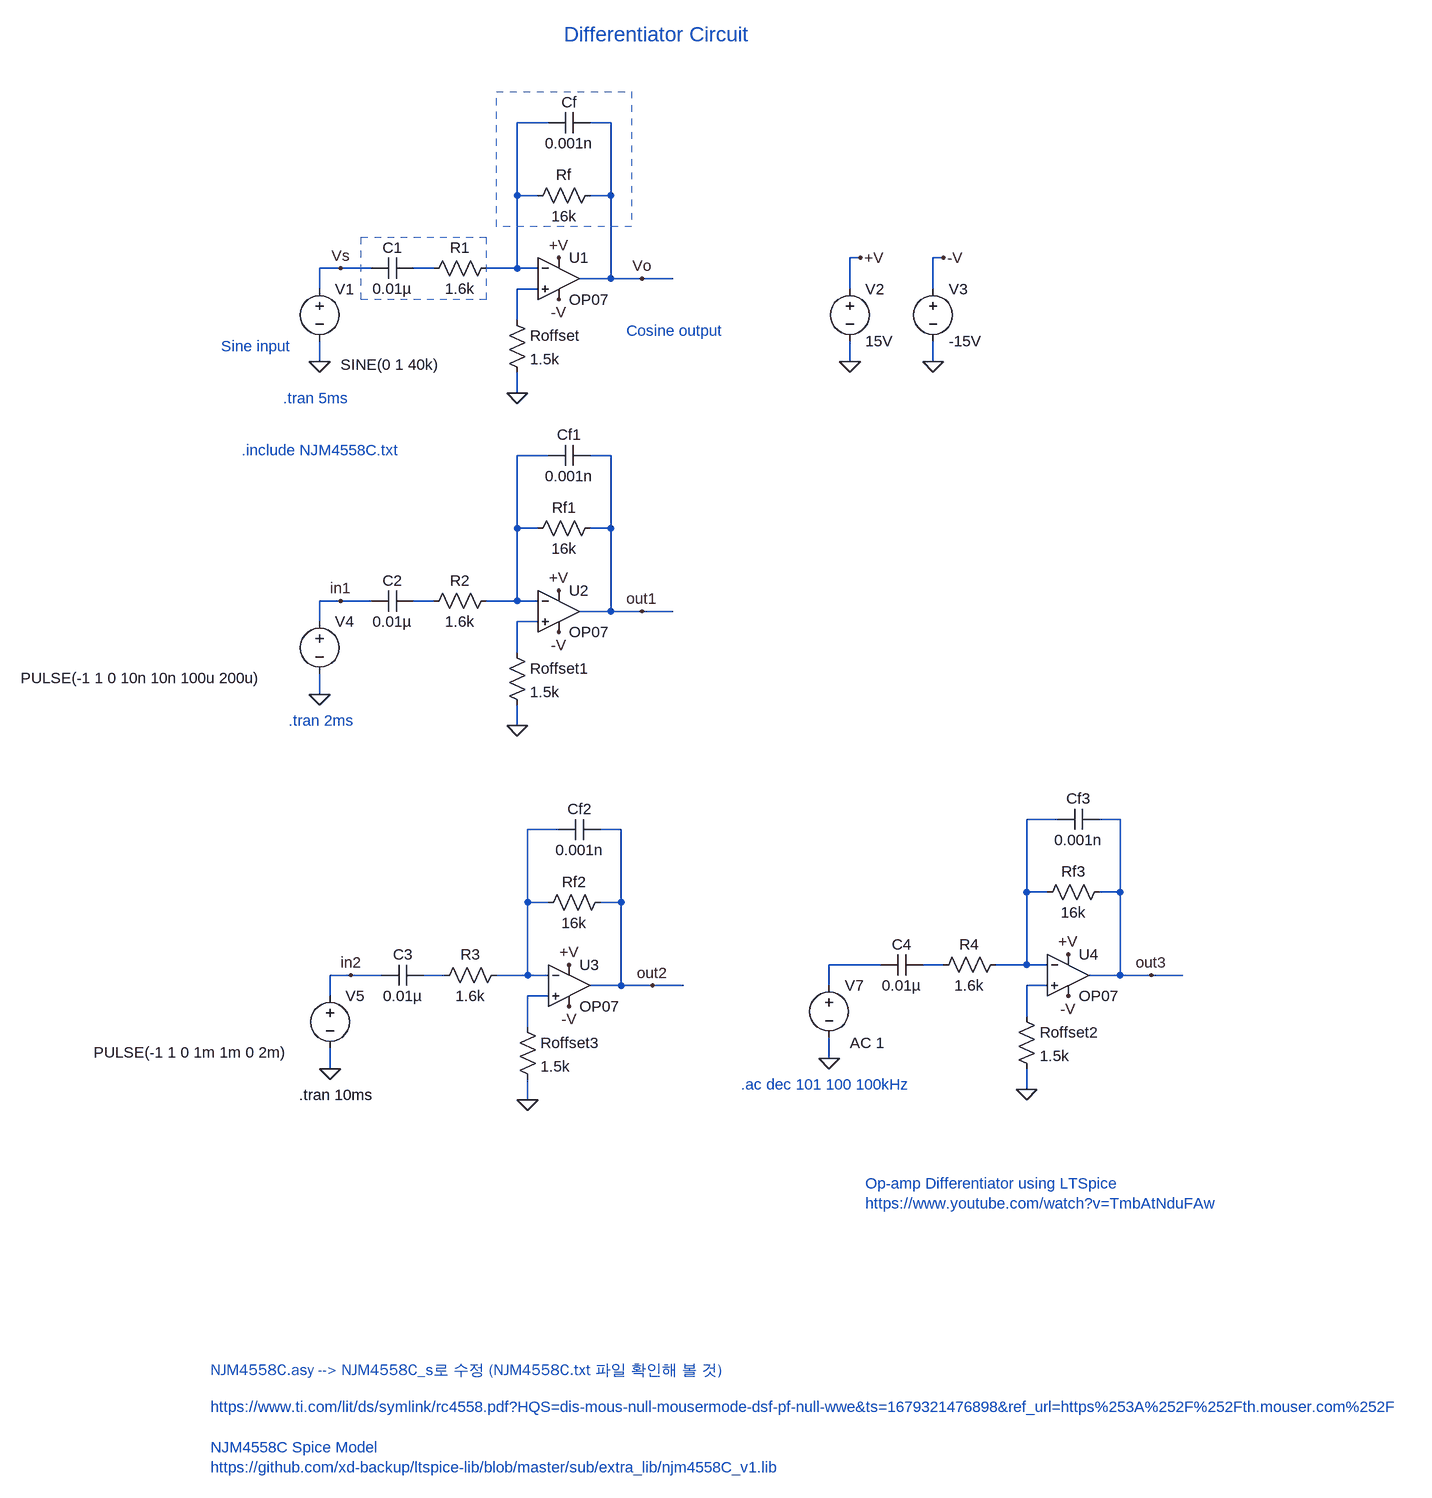
[diagram p0: schematic Differentialtor.asc]
Differentialtor.asc, the LTspice schematic file:
Version 4
SHEET 1 2012 1856
WIRE 96 -240 48 -240
WIRE 192 -240 160 -240
WIRE 48 -128 48 -240
WIRE 80 -128 48 -128
WIRE 192 -128 192 -240
WIRE 192 -128 160 -128
WIRE 576 -32 560 -32
WIRE 704 -32 688 -32
WIRE -224 -16 -256 -16
WIRE -176 -16 -224 -16
WIRE -80 -16 -112 -16
WIRE 48 -16 48 -128
WIRE 48 -16 0 -16
WIRE 80 -16 48 -16
WIRE 192 0 192 -128
WIRE 192 0 144 0
WIRE 240 0 192 0
WIRE 288 0 240 0
WIRE -256 16 -256 -16
WIRE 80 16 48 16
WIRE 560 16 560 -32
WIRE 688 16 688 -32
WIRE 48 64 48 16
WIRE -256 128 -256 96
WIRE 560 128 560 96
WIRE 688 128 688 96
WIRE 48 176 48 144
WIRE 96 272 48 272
WIRE 192 272 160 272
WIRE 48 384 48 272
WIRE 80 384 48 384
WIRE 192 384 192 272
WIRE 192 384 160 384
WIRE -224 496 -256 496
WIRE -176 496 -224 496
WIRE -80 496 -112 496
WIRE 48 496 48 384
WIRE 48 496 0 496
WIRE 80 496 48 496
WIRE 192 512 192 384
WIRE 192 512 144 512
WIRE 240 512 192 512
WIRE 288 512 240 512
WIRE -256 528 -256 496
WIRE 80 528 48 528
WIRE 48 576 48 528
WIRE -256 640 -256 608
WIRE 48 688 48 656
WIRE 880 832 832 832
WIRE 976 832 944 832
WIRE 112 848 64 848
WIRE 208 848 176 848
WIRE 832 944 832 832
WIRE 864 944 832 944
WIRE 976 944 976 832
WIRE 976 944 944 944
WIRE 64 960 64 848
WIRE 96 960 64 960
WIRE 208 960 208 848
WIRE 208 960 176 960
WIRE 608 1056 528 1056
WIRE 704 1056 672 1056
WIRE 832 1056 832 944
WIRE 832 1056 784 1056
WIRE 864 1056 832 1056
WIRE -208 1072 -240 1072
WIRE -160 1072 -208 1072
WIRE -64 1072 -96 1072
WIRE 64 1072 64 960
WIRE 64 1072 16 1072
WIRE 96 1072 64 1072
WIRE 976 1072 976 944
WIRE 976 1072 928 1072
WIRE 1024 1072 976 1072
WIRE 1072 1072 1024 1072
WIRE 208 1088 208 960
WIRE 208 1088 160 1088
WIRE 256 1088 208 1088
WIRE 304 1088 256 1088
WIRE 528 1088 528 1056
WIRE 864 1088 832 1088
WIRE -240 1104 -240 1072
WIRE 96 1104 64 1104
WIRE 832 1136 832 1088
WIRE 64 1152 64 1104
WIRE 528 1200 528 1168
WIRE -240 1216 -240 1184
WIRE 832 1248 832 1216
WIRE 64 1264 64 1232
FLAG -256 128 0
FLAG 560 128 0
FLAG 576 -32 +V
FLAG 688 128 0
FLAG 704 -32 -V
FLAG 112 -32 +V
FLAG 112 32 -V
FLAG -224 -16 Vs
FLAG 48 176 0
FLAG 240 0 Vo
FLAG -256 640 0
FLAG 112 480 +V
FLAG 112 544 -V
FLAG -224 496 in1
FLAG 48 688 0
FLAG 240 512 out1
FLAG -240 1216 0
FLAG 128 1056 +V
FLAG 128 1120 -V
FLAG -208 1072 in2
FLAG 64 1264 0
FLAG 256 1088 out2
FLAG 528 1200 0
FLAG 896 1040 +V
FLAG 896 1104 -V
FLAG 832 1248 0
FLAG 1024 1072 out3
SYMBOL res 16 -32 R90
WINDOW 0 0 56 VBottom 2
WINDOW 3 32 56 VTop 2
SYMATTR InstName R1
SYMATTR Value 1.6k
SYMBOL res 176 -144 R90
WINDOW 0 0 56 VBottom 2
WINDOW 3 32 56 VTop 2
SYMATTR InstName Rf
SYMATTR Value 16k
SYMBOL voltage 560 0 R0
SYMATTR InstName V2
SYMATTR Value 15V
SYMBOL voltage 688 0 R0
SYMATTR InstName V3
SYMATTR Value -15V
SYMBOL cap -112 -32 R90
WINDOW 0 0 32 VBottom 2
WINDOW 3 32 32 VTop 2
SYMATTR InstName C1
SYMATTR Value 0.01µ
SYMBOL res 32 48 R0
SYMATTR InstName Roffset
SYMATTR Value 1.5k
SYMBOL cap 160 -256 R90
WINDOW 0 0 32 VBottom 2
WINDOW 3 32 32 VTop 2
SYMATTR InstName Cf
SYMATTR Value 0.001n
SYMBOL Opamps\\OP07 112 -64 R0
SYMATTR InstName U1
SYMBOL voltage -256 512 R0
WINDOW 123 0 0 Left 0
WINDOW 39 0 0 Left 0
WINDOW 3 -460 103 Left 2
SYMATTR Value PULSE(-1 1 0 10n 10n 100u 200u)
SYMATTR InstName V4
SYMBOL res 16 480 R90
WINDOW 0 0 56 VBottom 2
WINDOW 3 32 56 VTop 2
SYMATTR InstName R2
SYMATTR Value 1.6k
SYMBOL res 176 368 R90
WINDOW 0 0 56 VBottom 2
WINDOW 3 32 56 VTop 2
SYMATTR InstName Rf1
SYMATTR Value 16k
SYMBOL cap -112 480 R90
WINDOW 0 0 32 VBottom 2
WINDOW 3 32 32 VTop 2
SYMATTR InstName C2
SYMATTR Value 0.01µ
SYMBOL res 32 560 R0
SYMATTR InstName Roffset1
SYMATTR Value 1.5k
SYMBOL cap 160 256 R90
WINDOW 0 0 32 VBottom 2
WINDOW 3 32 32 VTop 2
SYMATTR InstName Cf1
SYMATTR Value 0.001n
SYMBOL Opamps\\OP07 112 448 R0
SYMATTR InstName U2
SYMBOL voltage -240 1088 R0
WINDOW 123 0 0 Left 0
WINDOW 39 0 0 Left 0
WINDOW 3 -364 103 Left 2
SYMATTR Value PULSE(-1 1 0 1m 1m 0 2m)
SYMATTR InstName V5
SYMBOL res 32 1056 R90
WINDOW 0 0 56 VBottom 2
WINDOW 3 32 56 VTop 2
SYMATTR InstName R3
SYMATTR Value 1.6k
SYMBOL res 192 944 R90
WINDOW 0 0 56 VBottom 2
WINDOW 3 32 56 VTop 2
SYMATTR InstName Rf2
SYMATTR Value 16k
SYMBOL cap -96 1056 R90
WINDOW 0 0 32 VBottom 2
WINDOW 3 32 32 VTop 2
SYMATTR InstName C3
SYMATTR Value 0.01µ
SYMBOL res 48 1136 R0
SYMATTR InstName Roffset3
SYMATTR Value 1.5k
SYMBOL cap 176 832 R90
WINDOW 0 0 32 VBottom 2
WINDOW 3 32 32 VTop 2
SYMATTR InstName Cf2
SYMATTR Value 0.001n
SYMBOL Opamps\\OP07 128 1024 R0
SYMATTR InstName U3
SYMBOL res 800 1040 R90
WINDOW 0 0 56 VBottom 2
WINDOW 3 32 56 VTop 2
SYMATTR InstName R4
SYMATTR Value 1.6k
SYMBOL res 960 928 R90
WINDOW 0 0 56 VBottom 2
WINDOW 3 32 56 VTop 2
SYMATTR InstName Rf3
SYMATTR Value 16k
SYMBOL voltage 528 1072 R0
WINDOW 123 32 104 Left 2
WINDOW 39 0 0 Left 0
WINDOW 3 10 96 Left 2
SYMATTR Value2 AC 1
SYMATTR Value ""
SYMATTR InstName V7
SYMBOL cap 672 1040 R90
WINDOW 0 0 32 VBottom 2
WINDOW 3 32 32 VTop 2
SYMATTR InstName C4
SYMATTR Value 0.01µ
SYMBOL res 816 1120 R0
SYMATTR InstName Roffset2
SYMATTR Value 1.5k
SYMBOL cap 944 816 R90
WINDOW 0 0 32 VBottom 2
WINDOW 3 32 32 VTop 2
SYMATTR InstName Cf3
SYMATTR Value 0.001n
SYMBOL Opamps\\OP07 896 1008 R0
SYMATTR InstName U4
SYMBOL voltage -256 0 R0
WINDOW 123 32 104 Left 2
WINDOW 39 0 0 Left 0
WINDOW 3 32 132 Left 2
SYMATTR Value SINE(0 1 40k)
SYMATTR InstName V1
TEXT -424 1736 Left 2 ;https://www.ti.com/lit/ds/symlink/rc4558.pdf?HQS=dis-mous-null-mousermode-dsf-pf-null-wwe&ts=1679321476898&ref_url=https%253A%252F%252Fth.mouser.com%252F\n \nNJM4558C Spice Model\nhttps://github.com/xd-backup/ltspice-lib/blob/master/sub/extra_lib/njm4558C_v1.lib
TEXT -376 264 Left 2 ;.include NJM4558C.txt
TEXT -312 184 Left 2 ;.tran 5ms
TEXT -424 1680 Left 2 ;NJM4558C.asy --> NJM4558C_s로 수정 (NJM4558C.txt 파일 확인해 볼 것)
TEXT -304 680 Left 2 ;.tran 2ms
TEXT -288 1256 Left 2 !.tran 10ms
TEXT 584 1392 Left 2 ;Op-amp Differentiator using LTSpice\nhttps://www.youtube.com/watch?v=TmbAtNduFAw
TEXT -408 104 Left 2 ;Sine input
TEXT 216 80 Left 2 ;Cosine output
TEXT 392 1240 Left 2 ;.ac dec 101 100 100kHz
TEXT 120 -376 Left 3 ;Differentiator Circuit
RECTANGLE Normal 0 32 -192 -64 2
RECTANGLE Normal 224 -80 16 -288 2

The netlist it stands for:
* Differentialtor.asc
R1 N001 N002 1.6k
Rf Vo N001 16k
V2 +V 0 15V
V3 -V 0 -15V
C1 N002 Vs 0.01µ
Roffset N003 0 1.5k
Cf Vo N001 0.001n
XU1 N003 N001 +V -V Vo LT1001  ; OP07, pins In+ In- V+ V- OUT
V4 in1 0 PULSE(-1 1 0 10n 10n 100u 200u)
R2 N004 N005 1.6k
Rf1 out1 N004 16k
C2 N005 in1 0.01µ
Roffset1 N006 0 1.5k
Cf1 out1 N004 0.001n
XU2 N006 N004 +V -V out1 LT1001  ; OP07, pins In+ In- V+ V- OUT
V5 in2 0 PULSE(-1 1 0 1m 1m 0 2m)
R3 N008 N011 1.6k
Rf2 out2 N008 16k
C3 N011 in2 0.01µ
Roffset3 N013 0 1.5k
Cf2 out2 N008 0.001n
XU3 N013 N008 +V -V out2 LT1001  ; OP07, pins In+ In- V+ V- OUT
R4 N007 N010 1.6k
Rf3 out3 N007 16k
V7 N009 0 AC 1
C4 N010 N009 0.01µ
Roffset2 N012 0 1.5k
Cf3 out3 N007 0.001n
XU4 N012 N007 +V -V out3 LT1001  ; OP07, pins In+ In- V+ V- OUT
V1 Vs 0 SINE(0 1 40k)
* https://www.ti.com/lit/ds/symlink/rc4558.pdf?HQS=dis-mous-null-mousermode-dsf-pf-null-wwe&ts=1679321476898&ref_url=https%253A%252F%252Fth.mouser.com%252F
* NJM4558C Spice Model
* https://github.com/xd-backup/ltspice-lib/blob/master/sub/extra_lib/njm4558C_v1.lib
* .include NJM4558C.txt
* .tran 5ms
* NJM4558C.asy --> NJM4558C_s로 수정 (NJM4558C.txt 파일 확인해 볼 것)
* .tran 2ms
.tran 10ms
* Op-amp Differentiator using LTSpice
* https://www.youtube.com/watch?v=TmbAtNduFAw
* Sine input
* Cosine output
* .ac dec 101 100 100kHz
* Differentiator Circuit
.lib LTC.lib
.backanno
.end